# EAGLE design Nu1 Capsule (EAGLE 6.3)
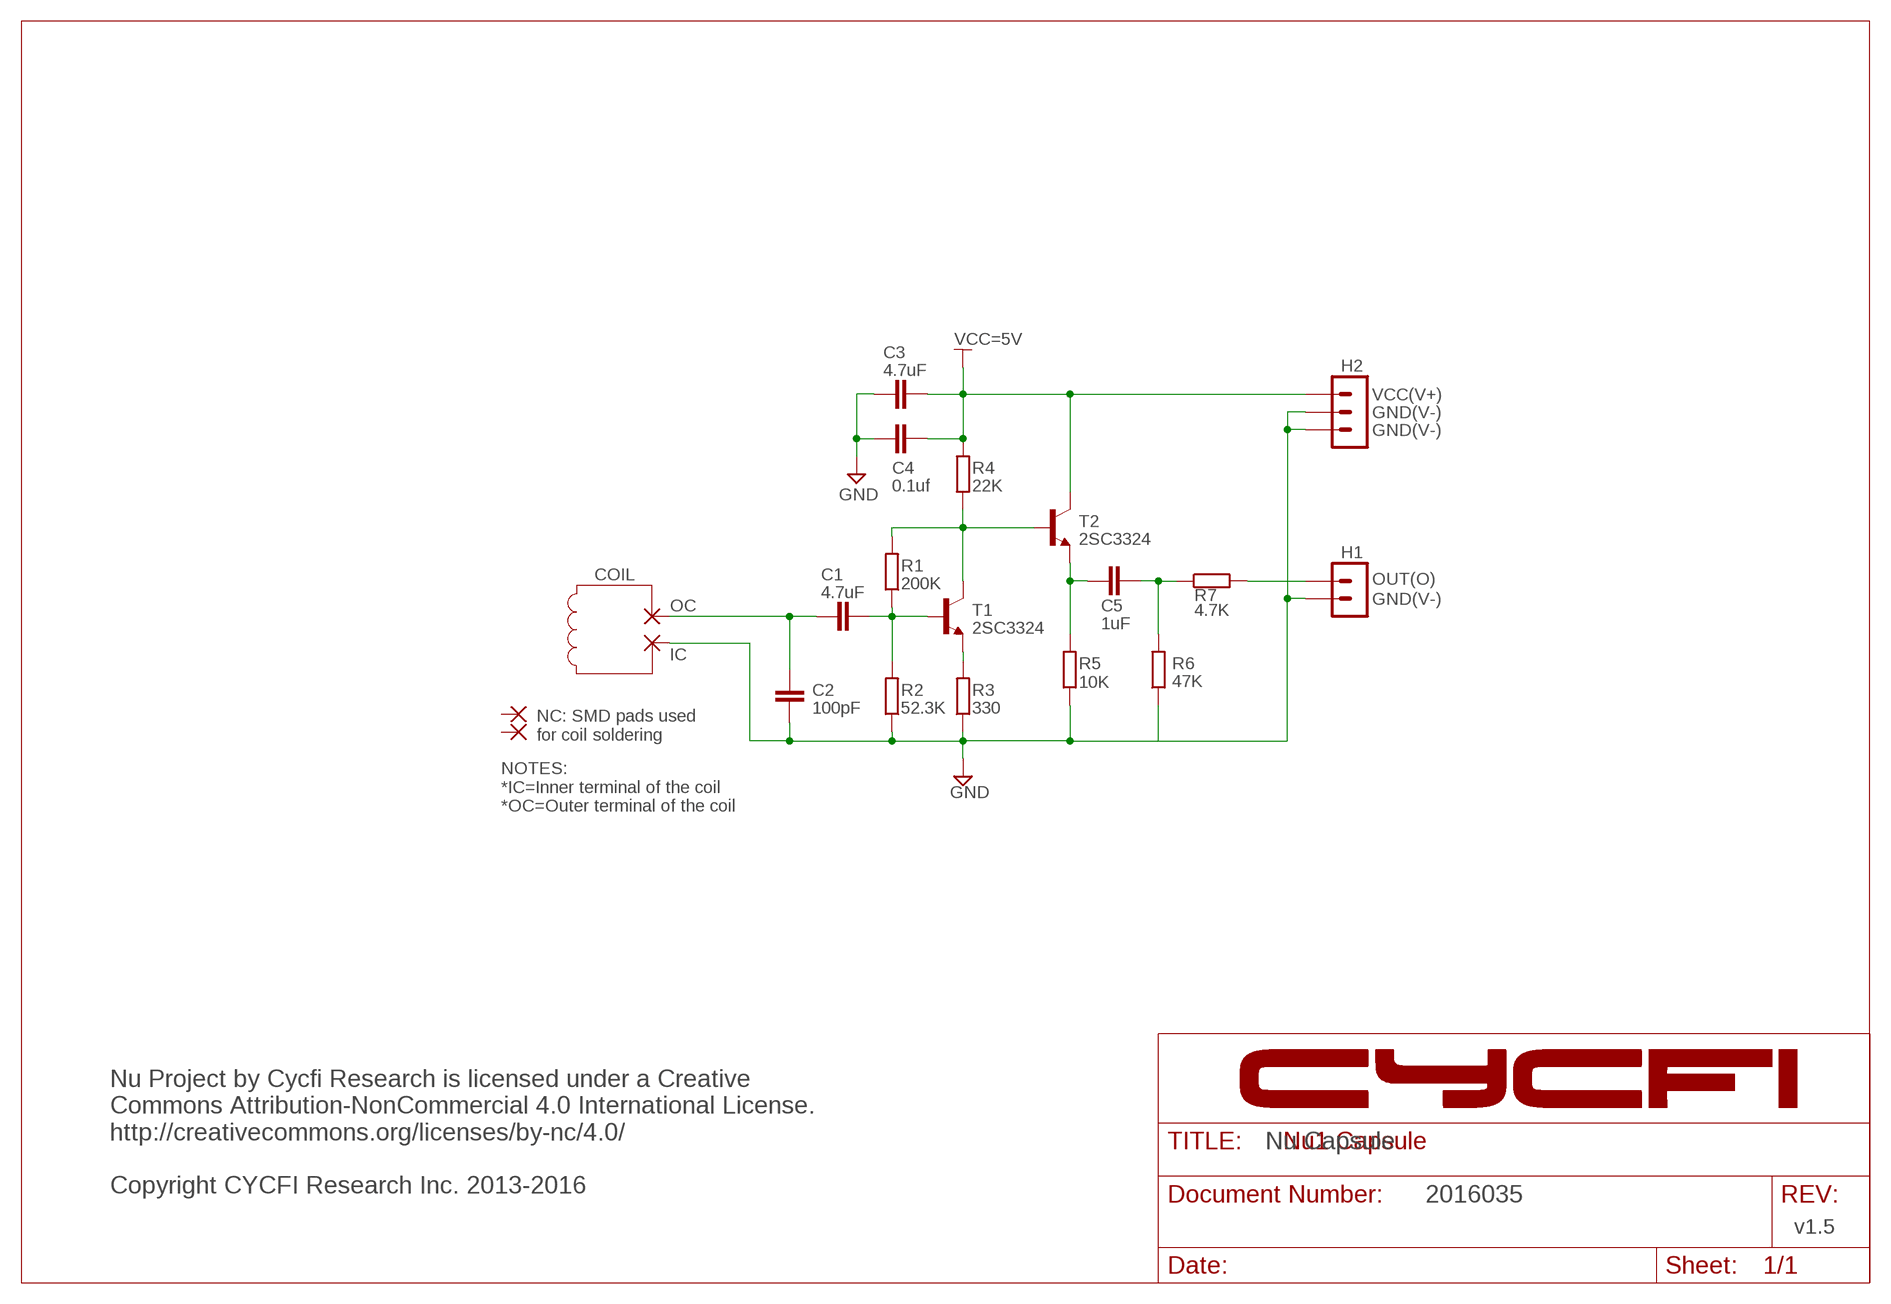
[diagram p0: schematic, sheet 1]

## Parts
C1  4.7uF  C-EUC0805  [C0805]
C2  100pF  C-EUC0603  [C0603]
C3  4.7uF  C-EUC0603  [C0603]
C4  0.1uf  C-EUC0603  [C0603]
C5  1uF  C-EUC0805  [C0805]
H1  2P-2MM-TH-MALE  [2P-2MM-TH]
H2  3P-2MM-TH-MALE  [3P-2MM-TH]
PAD6  WIREPADSMD1,27-254  [SMD1,27-2,54]
PAD7  WIREPADSMD1,27-254  [SMD1,27-2,54]
PAD18  WIREPADSMD1,27-254  [SMD1,27-2,54]
PAD19  WIREPADSMD1,27-254  [SMD1,27-2,54]
R1  200K  R-EU_R0603  [R0603]
R2  52.3K  R-EU_R0805  [R0805]
R3  330  R-EU_R0402  [R0402]
R4  22K  R-EU_R0402  [R0402]
R5  10K  R-EU_R0402  [R0402]
R6  47K  R-EU_R0402  [R0402]
R7  4.7K  R-EU_R0402  [R0402]
T1  2SC3324  BC846  [SOT23]
T2  2SC3324  BC846  [SOT23]

## Nets
GND: C2.1 C3.1 C4.1 H1.P$2 H2.P$2 H2.P$3 PAD7.1(P) R2.1 R3.1 R5.1 R6.1
N$1: C1.2 R1.1 R2.2 T1.1(B)
N$2: C1.1 C2.2 PAD6.1(P)
N$3: C5.2 R5.2 T2.2(E)
N$4: R3.2 T1.2(E)
OUT: C5.1 R6.2 R7.1
OUTPUT: H1.P$1 R7.2
VCVF: R1.2 R4.1 T1.3(C) T2.1(B)
VIN: C3.2 C4.2 H2.P$1 R4.2 T2.3(C)
Unconnected: PAD18.1(P) PAD19.1(P)

## Notes on the sheet
- VCC=5V
- VCC(V+)
- GND(V-)
- GND(V-)
- COIL | OUT(O)
- GND(V-)
- OC
- IC
- NC: SMD pads used
  for coil soldering
- NOTES:
  *IC=Inner terminal of the coil
  *OC=Outer terminal of the coil
- Nu Capsule
- Nu Project by Cycfi Research is licensed under a Creative 
  Commons Attribution-NonCommercial 4.0 International License. 
  http://creativecommons.org/licenses/by-nc/4.0/
  
  Copyright CYCFI Research Inc. 2013-2016
- 2016035
- v1.5

## Library data of the parts
C1-C5 = resistor:C-EU: CAPACITOR, European symbol
H1 = CYCFI_Con:2P-2MM-TH-MALE
H2 = CYCFI_Con:3P-2MM-TH-MALE
PAD6 PAD7 PAD18 PAD19 = wirepad:WIREPAD: Wire PAD connect wire on PCB
R1-R7 = resistor:R-EU_: RESISTOR, European symbol
T1 T2 = transistor:BC846: NPN TRANSISTOR

## Board
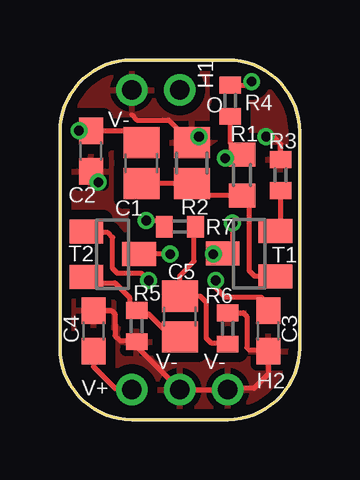
[diagram p1: board, top side]
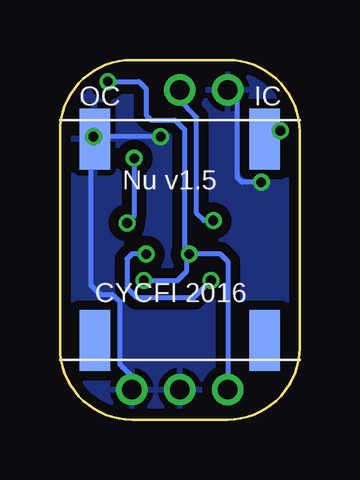
[diagram p2: board, bottom side, seen from below]

Size 10 x 15 mm. Coordinates in mm from the lower left corner, seen from the top.
Outline: 10,3 10,12 arc90 7,15 3,15 arc90 0,12 0,3 arc90 3,0 7,0 arc90 10,3
Copper layers (1*16): Top 0.035mm / dielectric 1.5mm / Bottom 0.035mm
Design rules "Fusion_eagle_rule_v1.1": minimum track width 6mil, minimum drill 12mil, track to track 6mil, track to pad 6mil, pad to pad 6mil, via to via 6mil, smd to smd 0mil, copper to edge 10mil, drill to drill 10mil, minimum pad ring 10mil, minimum via ring 6mil, stop-mask expansion 2mil, vias tented up to drill 100mil, thermal gap 10mil

### Footprints (pad centres in the part's own frame; a part is rotated, then mirrored left to right if it is on the bottom)
C0805 = smd 1.3 x 1.5: 1 -0.85,0; 2 0.85,0
C0603 = smd 1.1 x 1: 1 -0.85,0; 2 0.85,0
2P-2MM-TH = drill 0.8: P$1 -1,0; P$2 1,0
3P-2MM-TH = drill 0.8: P$1 -2,0; P$2 0,0; P$3 2,0
SMD1,27-2,54 = smd 1.27 x 2.54: 1 0,0
R0603 = smd 1 x 1.1: 1 -0.85,0; 2 0.85,0
R0805 = smd 1.3 x 1.5: 1 -0.85,0; 2 0.85,0
R0402 = smd 0.7 x 0.9: 1 -0.65,0; 2 0.65,0
SOT23 = smd 1 x 1.4: 1 -0.95,-1.1; 2 0.95,-1.1; 3 0,1.1

### Placement (x,y rotation side)
C1  3.4,10.7 270 top
C2  1.3,11.2 90 top
C3  8.7,3.7 90 top
C4  1.4,3.7 270 top
C5  5,4.3 270 top
H1  4,13.75 180 top
H2  5,1.25 0 top
PAD6  1.45,11.7 0 bottom
PAD7  8.55,11.7 0 bottom
PAD18  1.45,3.3 0 bottom
PAD19  8.55,3.3 0 bottom
R1  7.6,10.2 90 top
R2  5.5,10.7 270 top
R3  9.2,10.2 270 top
R4  7.1,13.3 90 top
R5  3.2,3.9 90 top
R6  7,3.8 270 top
R7  5,8.05 180 top
T1  7.89,6.92 90 top
T2  2.2,6.9 270 top

### Tracks (layer width: path | path; a pad name or v marks a point on that pad's centre or on a via)
GND  (via drill 0.4)
  Top 0.203: 3,12.7 3.2,12.5 4.55,12.5 R2.1 5.2,11.8 v5.8,11.8 | C2.1 1.3,10.2 v1.6,9.9 | v8.6,11.8 8.9,11.8 9.2,11.5 R3.1 | R5.1 3.2,3.05 | R6.1 7.65,4.45 7.8,4.3 7.8,3 7.9,2.9 8.65,2.9 C3.1 8.7,1.9 8.1,1.3 7.05,1.3 | C4.1 2.15,4.55 2.3,4.4 2.3,3.5 2.5,3.3 3.15,3.3 R5.1 | H2.P$3 H2.P$2 3.2,3.05 | R5.1 3.2,3.05
  Bottom 0.203: v1.6,9.9 2.4,9.9 2.6,10.1 2.6,13.35 | v8.6,11.8 9.05,12.2 PAD7.1 | v5.8,11.8 8.45,11.8 PAD7.1 | 7,1.8 7.5,2.3 7.5,4.9 7.8,5.2 8.3,5.2 8.7,5.6 8.7,11.55 PAD7.1
  pour Top (isolate 0.406): 0,15 10,15 10,0 0,0
  pour Bottom (isolate 0.406): 0,15 10,15 10,0 0,0
N$1
  Top 0.203: R2.2 C1.2 | 6.15,10.2 R2.2 | R2.2 6,9.35 R1.1 7.9,9.05 7.9,6.2 8.13,5.97 T1.1
N$2  (via drill 0.4)
  Top 0.203: C1.1 3,11.95 2.9,12.05 C2.2 0.75,12.05 v0.8,12.05
  Bottom 0.203: v0.8,12.05 1.2,11.95 PAD6.1
N$3
  Top 0.203: C5.2 4.7,3.15 4.7,3.4 3.7,4.4 3.35,4.4 R5.2 2.9,4.85 2.9,5.1 2.3,5.7 1.35,5.7 T2.2
N$4
  Top 0.203: R3.2 9.2,8.08 T1.2
OUT
  Top 0.203: R7.1 5.6,8.05 5.6,6.6 5,6 C5.1 5.85,5.15 6.1,4.9 6.1,3.4 6.3,3.2 6.95,3.2 R6.2
OUTPUT  (via drill 0.4)
  Top 0.203: v3.6,8.3 4.05,8.3 R7.2
  Bottom 0.203: v3.6,8.3 4,8.3 4.3,8.6 4.3,12.6 4.4,12.7 5,13.3 H1.P$1
VCVF  (via drill 0.4)
  Top 0.203: 7.4,11.45 R1.2 | R4.1 7.1,11.55 R1.2 | R1.2 7.05,11.05 v6.9,10.9 | v7.2,8.2 7.2,7.33 T1.3 6.42,6.92 v6.4,6.9 | v3.7,5.8 3.5,6 3.4,6.1 2.4,6.1 2.2,6.3 2.2,7.6 2,7.8 1.15,7.8 T2.1
  Bottom 0.203: v6.9,10.9 6.9,8.5 v7.2,8.2 | v6.4,6.9 7,6.9 7.1,6.8 7.2,6.7 7.2,5.5 6.8,5.1 4.4,5.1 v3.7,5.8
VIN  (via drill 0.4)
  Top 0.203: R4.2 7.85,13.95 v8,14.1 | v4.6,6.9 T2.3 | C3.2 8.7,4.8 8.4,5.1 6.9,5.1 6.5,5.5 v6.5,5.8 | C4.2 1.4,2.2 2.3,1.3 2.95,1.3 H2.P$1
  Bottom 0.203: v8,14.1 6.7,14.1 6.4,13.8 6.4,12.7 6.2,12.5 5.2,12.5 4.8,12.1 4.8,7.1 v4.6,6.9 | v6.5,5.8 5.1,5.8 4.7,6.2 4.7,6.8 v4.6,6.9 | v4.6,6.9 T2.3 3,6.6 H2.P$1

### Text on the board
tNames: H1 | O | V- | V- | V- | V+ | H2
bNames: IC | OC | Nu v1.5 | CYCFI 2016
_tNames: R4 | R1 | R3 | C2 | C1 | R2 | R7 | T2 | T1 | C5 | R5 | R6 | C3 | C4